# EAGLE design sustentation57-2 (EAGLE 5.07)
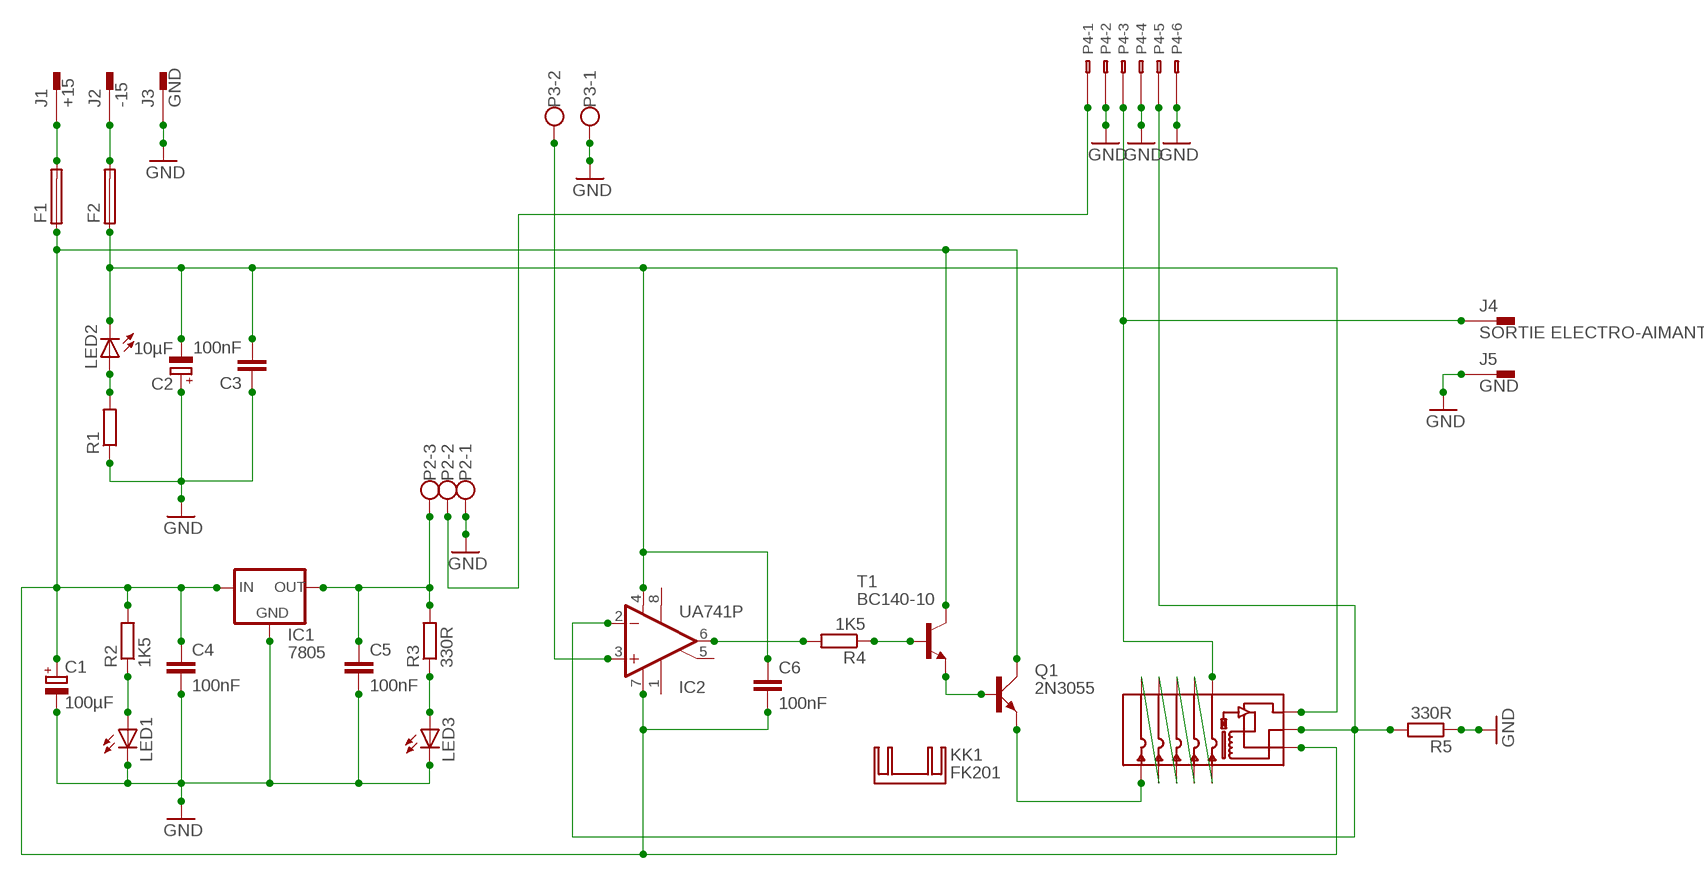
[diagram p0: schematic, sheet 1]

## Parts
C1  100µF  CPOL-EUE25-9AXIAL  [E25-9]
C2  10µF  CPOL-EUE5-5  [E5-5]
C3  100nF  C-EU050-024X044  [C050-024X044]
C4  100nF  C-EU050-024X044  [C050-024X044]
C5  100nF  C-EU050-024X044  [C050-024X044]
C6  100nF  C-EU050-024X044  [C050-024X044]
F1  KS9V  [KS9V]
F2  KS9V  [KS9V]
IC1  7805  78XXS  [78XXS]
IC2  UA741P  [DIL08]
J1  +15  PIN2F061.100  [F061.100]
J2  -15  PIN2F061.100  [F061.100]
J3  GND  PIN2F061.100  [F061.100]
J4  SORTIE ELECTRO-AIMANT  PIN2F061.100  [F061.100]
J5  GND  PIN2F061.100  [F061.100]
KK1  FK201  [FK201]
LED1  LED3MM  [LED3MM]
LED2  LED3MM  [LED3MM]
LED3  LED3MM  [LED3MM]
P2  W237-3E  [W237-3E]
P3  W237-02P  [W237-132]
P4  WAGO6-255-406-5  [255-406-5]
Q1  2N3055  [TO3A]
R1  R-EU_0309/10  [0309/10]
R2  1K5  R-EU_0309/10  [0309/10]
R3  330R  R-EU_0309/10  [0309/10]
R4  1K5  R-EU_0309/10  [0309/10]
R5  330R  R-EU_0309/10  [0309/10]
T1  BC140-10  BC140-10-NPN-TO39-EBC  [TO39]
U$1  LA25-NP  [LA25-NP]

## Nets
GND: C1.- C2.+ C3.1 C4.2 C5.2 IC1.GND J3.A1 J5.A1 LED1.K(C) LED3.K(C) P2.1 P3.1 P4.B2(-2:B1) P4.B4(-4:B1) P4.B6(-6:B1) R1.1 R5.1
N$1: F1.2 J1.A1
N$2: F2.2 J2.A1
N$3: C2.- C3.2 C6.1 F2.1 IC2.4(V-) LED2.K(C) U$1.-(V-)
N$4: LED2.A R1.2
N$5: LED3.A R3.1
N$6: C1.+ C4.1 C6.2 F1.1 IC1.IN IC2.7(V+) Q1.C1(C) R2.2 T1.3(C) U$1.+(V+)
N$7: LED1.A R2.1
N$8: C5.1 IC1.OUT P2.3 R3.2
N$9: IC2.3(+IN) P3.2
N$10: IC2.6(OUT) R4.2
N$11: Q1.B T1.1(E)
N$12: R4.1 T1.2(B)
N$13: P2.2 P4.B1(-1:B1)
N$14: Q1.E U$1.P$1
N$15: U$1.P$2 U$1.P$10
N$16: U$1.P$3 U$1.P$9
N$17: U$1.P$4 U$1.P$8
N$18: U$1.P$5 U$1.P$7
N$19: J4.A1 P4.B3(-3:B1) U$1.P$6
N$20: IC2.2(-IN) P4.B5(-5:B1) R5.2 U$1.M
Unconnected: IC2.1(ON1) IC2.5(ON2) IC2.8(OPT) J1.A2(1.1) J2.A2(1.1) J3.A2(1.1) J4.A2(1.1) J5.A2(1.1) P4.A1(-1:A1) P4.A2(-2:A1) P4.A3(-3:A1) P4.A4(-4:A1) P4.A5(-5:A1) P4.A6(-6:A1) Q1.C

## Library data of the parts
C1 C2 = rcl:CPOL-EU: POLARIZED CAPACITOR, European symbol
C3-C6 = rcl:C-EU: CAPACITOR, European symbol
F1 F2 = fuse:KS9V: FUSE HOLDER CS, Schukat
IC1 = v-reg:78XXS: VOLTAGE REGULATOR
IC2 = linear:*741: OP AMP
J1-J5 = con-faston:PIN2: Flachstecker Typ Tyco/Electronics/AMP TAB, FASTON Printed Circuit Board Tabs Source: http://www.buerklin.com, http://catalog.tycoelectronics.com
KK1 = heatsink:FK201: HEATSINK manufacturer Fischer/distributor Buerklin
LED1-LED3 = led:LED: LED OSRAM: - CHIPLED LG R971, LG N971, LY N971, LG Q971, LY Q971, LO R971, LY R971 LH N974, LH R974 LS Q976, LO Q976, LY Q976 LO Q996 - Hyper CHIPLED LW Q18S LB Q993, LB Q99A, LB R99A - SideLED LS A670, LO A670, LY A670, LG A670, LP A670 LB A673, LV A673, LT A673, LW A673 LH A674 LY A675 LS A676, LA A676, LO A676, LY A676, LW A676 LS A679, LY A679, LG A679 - Hyper Micro SIDELED® LS Y876, LA Y876, LO Y876, LY Y876 LT Y87S - SmartLED LW L88C, LW L88S LB L89C, LB L89S, LG L890 LS L89K, LO L89K, LY L89K LS L896, LA L896, LO L896, LY L896 - TOPLED LS T670, LO T670, LY T670, LG T670, LP T670 LSG T670, LSP T670, LSY T670, LOP T670, LYG T670 LG T671, LOG T671, LSG T671 LB T673, LV T673, LT T673, LW T673 LH T674 LS T676, LA T676, LO T676, LY T676, LB T676, LH T676, LSB T676, LW T676 LB T67C, LV T67C, LT T67C, LS T67K, LO T67K, LY T67K, LW E67C LS E67B, LA E67B, LO E67B, LY E67B, LB E67C, LV E67C, LT E67C LW T67C LS T679, LY T679, LG T679 LS T770, LO T770, LY T770, LG T770, LP T770 LB T773, LV T773, LT T773, LW T773 LH T774 LS E675, LA E675, LY E675, LS T675 LS T776, LA T776, LO T776, LY T776, LB T776 LHGB T686 LT T68C, LB T68C - Hyper Mini TOPLED® LB M676 - Mini TOPLED Santana® LG M470 LS M47K, LO M47K, LY M47K Source: http://www.osram.convergy.de LUXEON: - LUMILED® LXK2-PW12-R00, LXK2-PW12-S00, LXK2-PW14-U00, LXK2-PW14-V00 LXK2-PM12-R00, LXK2-PM12-S00, LXK2-PM14-U00 LXK2-PE12-Q00, LXK2-PE12-R00, LXK2-PE12-S00, LXK2-PE14-T00, LXK2-PE14-U00 LXK2-PB12-K00, LXK2-PB12-L00, LXK2-PB12-M00, LXK2-PB14-N00, LXK2-PB14-P00, LXK2-PB14-Q00 LXK2-PR12-L00, LXK2-PR12-M00, LXK2-PR14-Q00, LXK2-PR14-R00 LXK2-PD12-Q00, LXK2-PD12-R00, LXK2-PD12-S00 LXK2-PH12-R00, LXK2-PH12-S00 LXK2-PL12-P00, LXK2-PL12-Q00, LXK2-PL12-R00 Source: www.luxeon.com KINGBRIGHT: KA-3528ASYC Source: www.kingbright.com
P2 = con-wago-508:W237-3E: WAGO SREW CLAMP
P3 = con-wago-508:W237-02P: WAGO SREW CLAMP
P4 = con-wago:WAGO6-: WAGO Cage Clamp
Q1 = transistor-power:2N3055: NPN TRANSISTOR
R1-R5 = rcl:R-EU_: RESISTOR, European symbol
T1 = transistor:*-NPN-: NPN Transistror BF959 corrected 2008.03.06
U$1 = lem:LA25-NP

## Board
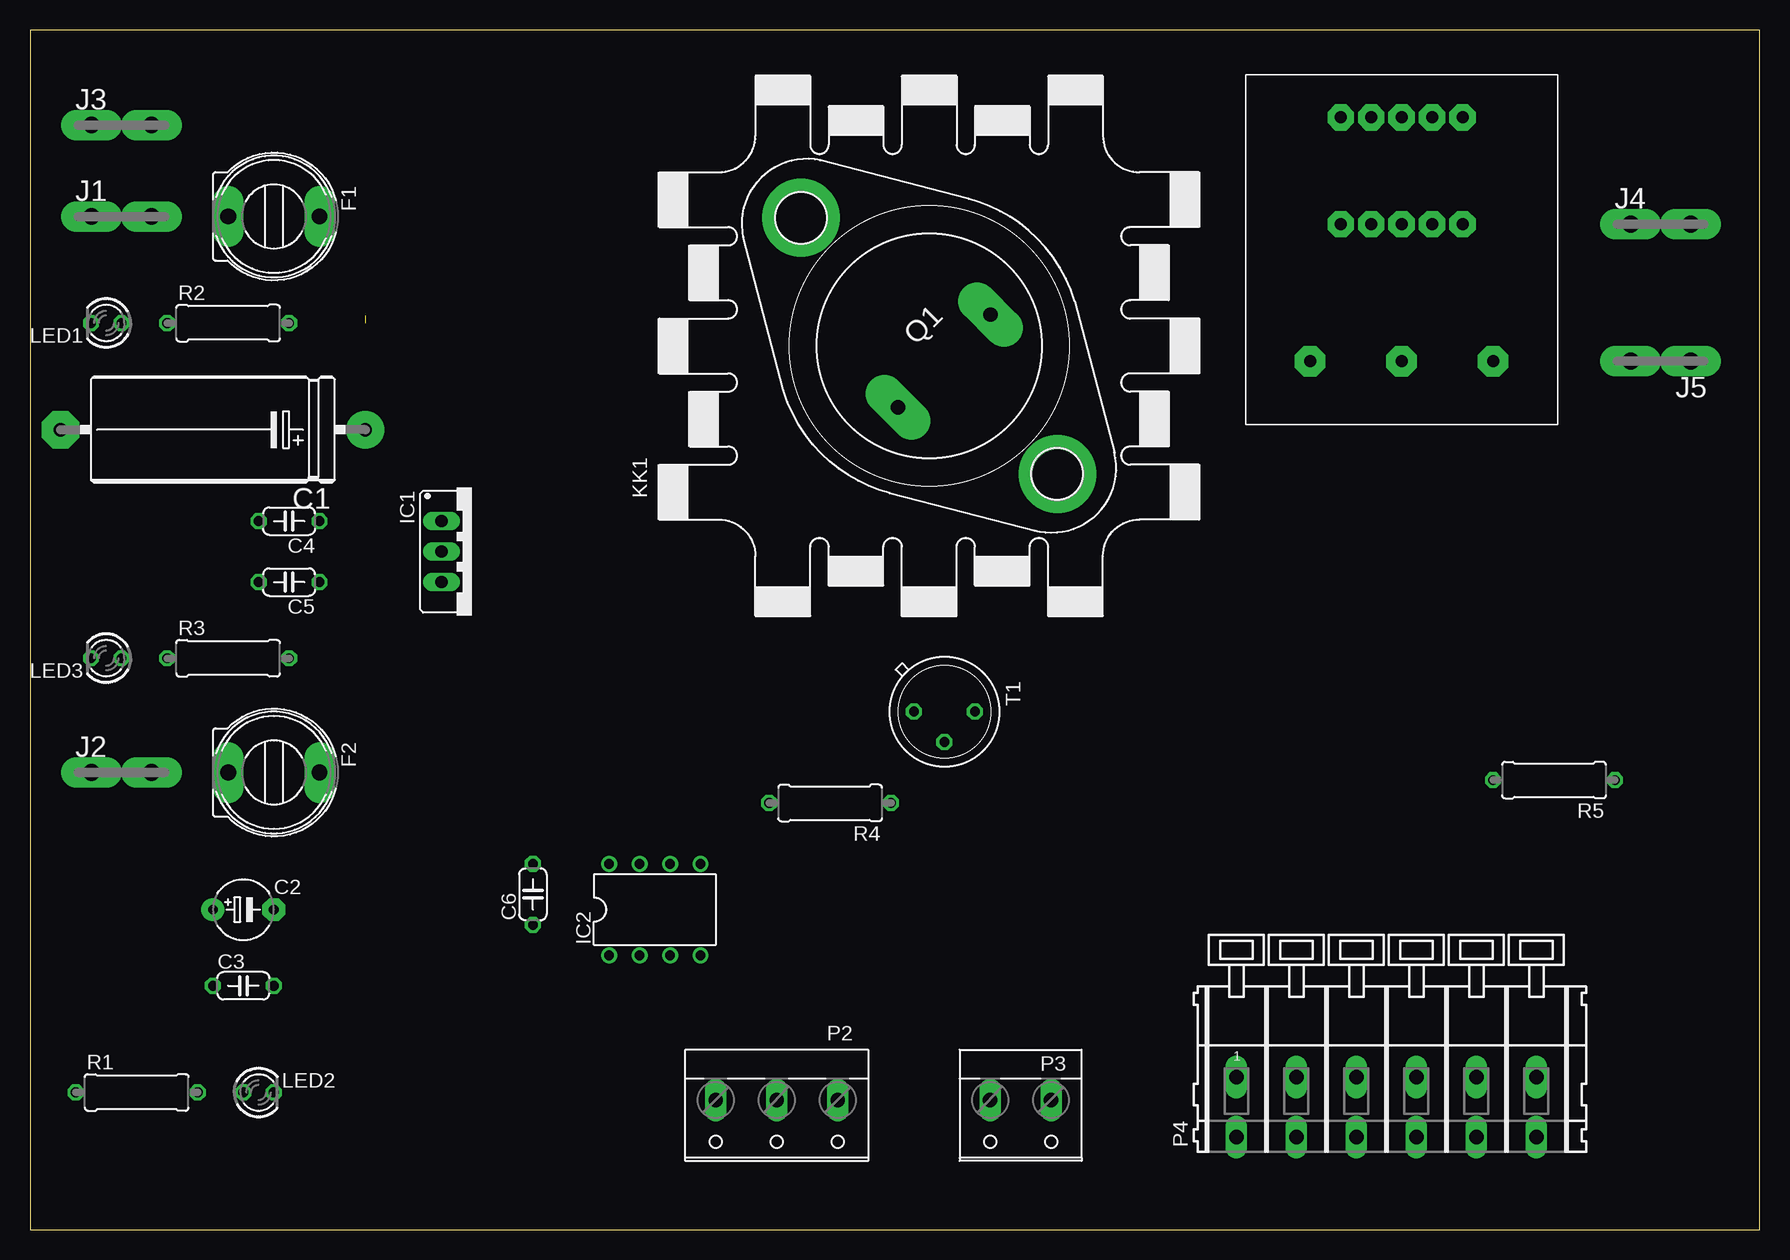
[diagram p1: board, top side]
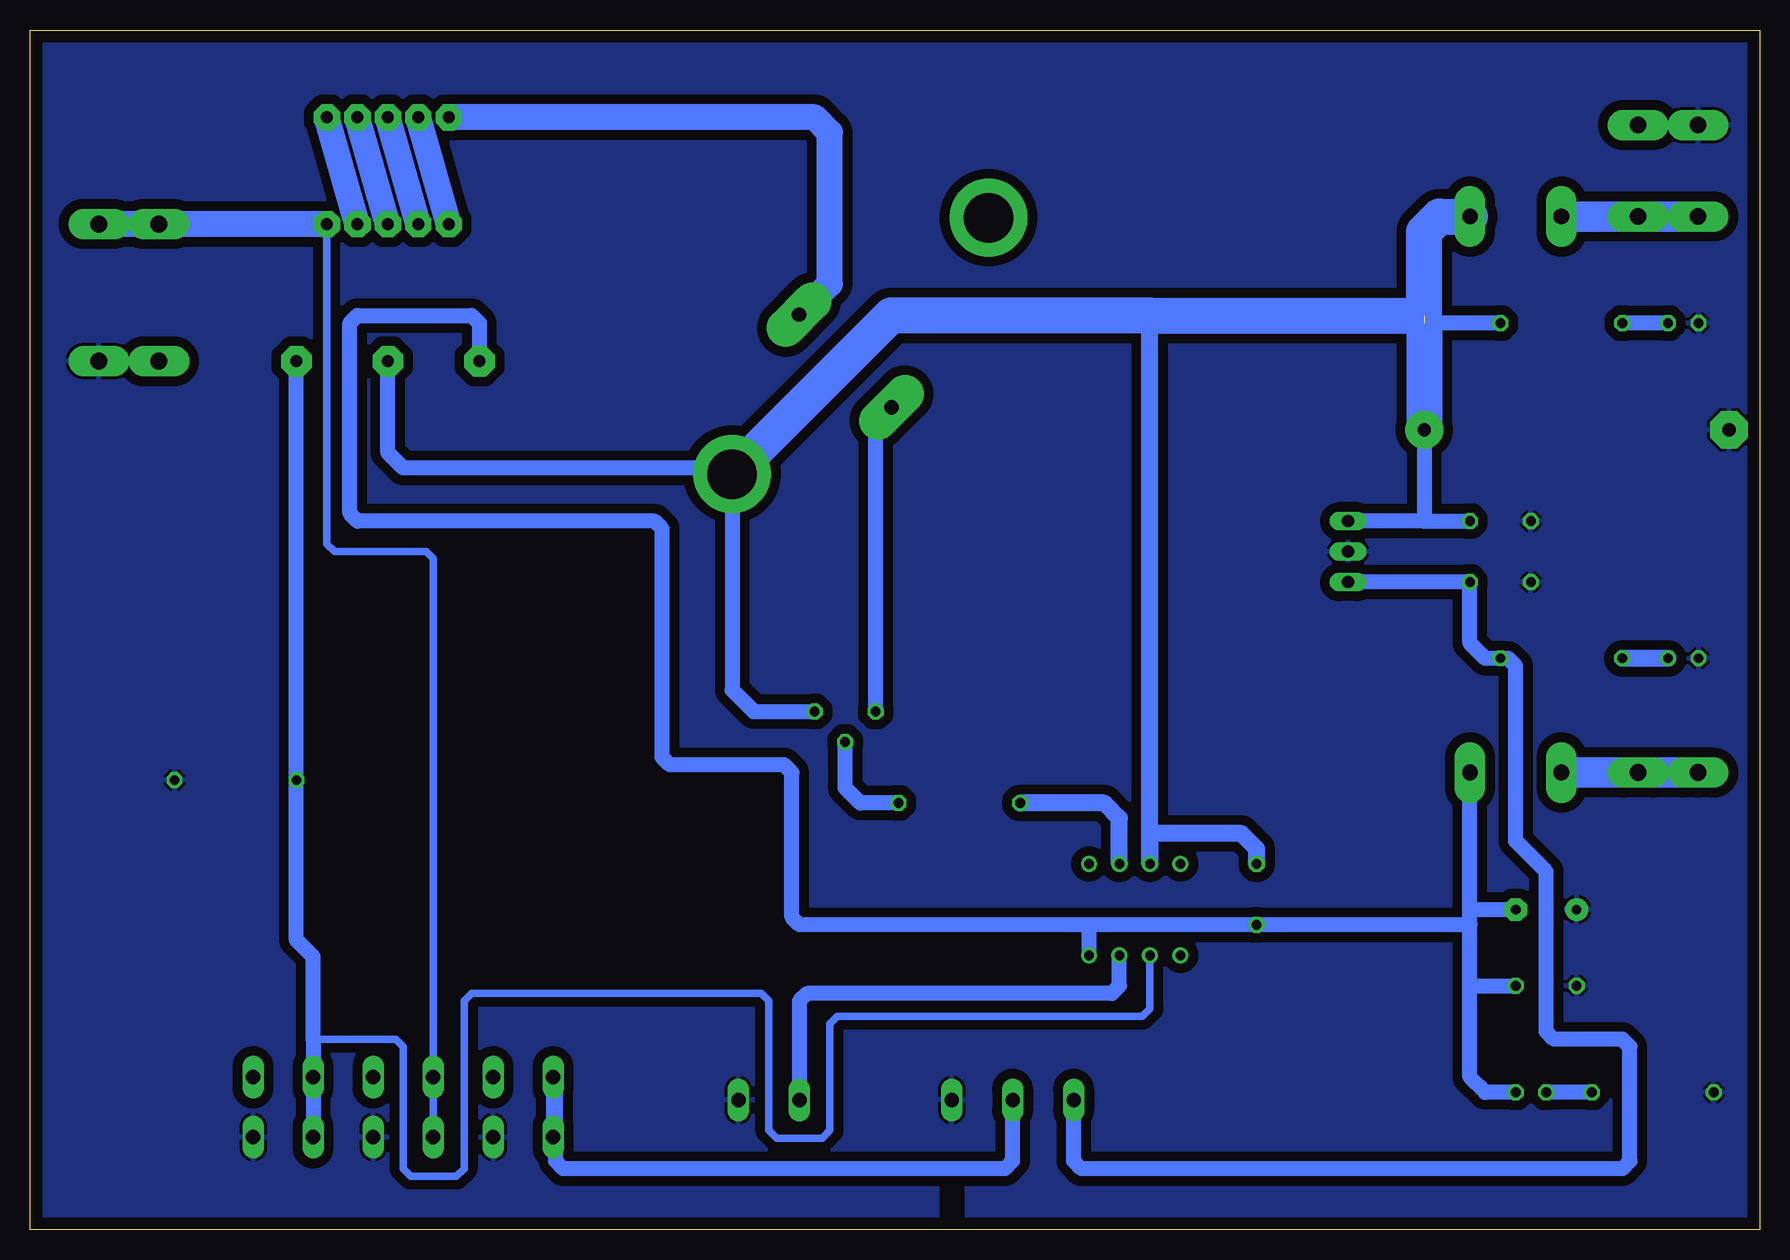
[diagram p2: board, bottom side, seen from below]

Size 144.12 x 100 mm. Coordinates in mm from the lower left corner, seen from the top.
Outline: 0,0 144.12,0 144.12,100 0,100 0,0
Copper layers (1*16): Top 0.035mm / dielectric 1.5mm / Bottom 0.035mm
Design rules "default": minimum track width 10mil, minimum drill 24mil, track to track 8mil, track to pad 8mil, pad to pad 8mil, via to via 8mil, smd to smd 8mil, copper to edge 40mil, drill to drill 8mil, minimum pad ring 10mil, minimum via ring 8mil, stop-mask expansion 4mil, vias tented up to drill 0mil, thermal gap 10mil

### Footprints (pad centres in the part's own frame; a part is rotated, then mirrored left to right if it is on the bottom)
E25-9 = drill 1.118 pad 3.15 round: + -12.7,0 | drill 1.118 pad 3.15 octagon: - 12.7,0
E5-5 = drill 0.813 pad 1.905 round: + -2.54,0 | drill 0.813 pad 1.905 octagon: - 2.54,0
C050-024X044 = drill 0.813 octagon: 1 -2.54,0; 2 2.54,0
KS9V = drill 1.321 pad 2.54 long: 1 0,3.81; 2 0,-3.81
78XXS = drill 1.016 long: GND 0,-2.54; IN -2.54,-2.54; OUT 2.54,-2.54
DIL08 = drill 0.813 pad 1.27 round: 1 -3.81,-3.81; 2 -1.27,-3.81; 3 1.27,-3.81; 4 3.81,-3.81; 5 3.81,3.81; 6 1.27,3.81; 7 -1.27,3.81; 8 -3.81,3.81
F061.100 = drill 1.4 pad 2.54 long: A1 -2.5,0; A2 2.5,0
LED3MM = drill 0.813 octagon: A -1.27,0; K 1.27,0
W237-3E = drill 1.194 long: 1 -5.08,-0.635; 2 0,-0.635; 3 5.08,-0.635
W237-132 = drill 1.194 long: 1 -2.54,-0.635; 2 2.54,-0.635
255-406-5 = drill 1.2 long: A1 -12.5,0; A2 -7.5,0; A3 -2.5,0; A4 2.5,0; A5 7.5,0; A6 12.5,0; B1 -12.5,-5; B2 -7.5,-5; B3 -2.5,-5; B4 2.5,-5; B5 7.5,-5; B6 12.5,-5
TO3A = drill 1.194 pad 3.15 long: B -1.778,5.461; E -1.778,-5.461 | drill 4.115 pad 6.477 round: C 15.113,0; C1 -15.113,0
0309/10 = drill 0.813 octagon: 1 -5.08,0; 2 5.08,0
TO39 = drill 0.813 octagon: 1 0,-2.54; 2 2.54,0; 3 0,2.54
LA25-NP = drill 1 pad 2.54 octagon: + 0,0; - -7.62,0; M 7.62,0 | drill 1 pad 2.184 octagon: P$1 -5.08,20.32; P$2 -2.54,20.32; P$3 0,20.32; P$4 2.54,20.32; P$5 5.08,20.32; P$6 5.08,11.43; P$7 2.54,11.43; P$8 0,11.43; P$9 -2.54,11.43; P$10 -5.08,11.43

### Placement (x,y rotation side)
C1  15.24,66.67 180 top
C2  17.78,26.67 0 top
C3  17.78,20.32 0 top
C4  21.59,59.05 180 top
C5  21.59,53.98 180 top
C6  41.91,27.94 90 top
F1  20.32,84.45 270 top
F2  20.32,38.1 270 top
IC1  36.83,56.52 270 top
IC2  52.07,26.67 0 top
J1  7.62,84.45 0 top
J2  7.62,38.1 0 top
J3  7.62,92.08 0 top
J4  135.89,83.82 0 top
J5  135.89,72.39 180 top
KK1  74.93,73.66 0 top
LED1  6.35,75.56 180 top
LED2  19.05,11.43 0 top
LED3  6.35,47.62 180 top
P2  62.23,10.16 180 top
P3  82.55,10.16 180 top
P4  113.03,12.7 0 top
Q1  74.93,73.66 135 top
R1  8.89,11.43 0 top
R2  16.51,75.56 0 top
R3  16.51,47.62 0 top
R4  66.67,35.56 180 top
R5  127,37.47 180 top
T1  76.2,43.18 270 top
U$1  114.3,72.39 0 top

### Tracks (layer width: path | path; a pad name or v marks a point on that pad's centre or on a via)
GND
  pour Bottom (isolate 0.813): 0,0 62.23,0 66.04,0 66.04,5.08 68.58,5.08 68.58,0 144.15,0 144.15,99.69 0,99.69
N$1
  Bottom 2.54: J1.A1 F1.2
N$2
  Bottom 2.54: J2.A1 F2.2
N$3
  Bottom 1.27: LED2.K 22.86,11.43 24.13,12.7 24.13,20.32 | 24.13,20.32 24.13,25.4 | 24.13,25.4 24.13,26.67 | 24.13,26.67 F2.1 | 24.13,26.67 C2.- | 24.13,20.32 C3.2 | 24.13,25.4 C6.1 55.88,25.4 | 55.88,25.4 IC2.4 | U$1.- 106.68,75.56 107.31,76.2 116.84,76.2 117.47,75.56 117.47,59.69 116.84,59.05 92.08,59.05 91.44,58.42 91.44,39.37 90.81,38.73 81.28,38.73 80.64,38.1 80.64,26.04 80.01,25.4 55.88,25.4
N$4
  Bottom 1.27: R1.2 LED2.A
N$5
  Bottom 1.422: LED3.A R3.1
N$6  (1 unrouted)
  Bottom 1.27: R2.2 27.94,75.56 | 27.94,59.05 C4.1 | 27.94,59.05 IC1.IN | C1.+ 27.94,59.05 | U$1.+ 114.3,64.77 113.03,63.5 85.09,63.5 | Q1.C1 85.62,44.98 83.82,43.18 T1.3
  Bottom 1.422: C6.2 41.91,31.75 43.18,33.02 50.8,33.02 IC2.7 50.8,76.2
  Bottom 2.184: 78.74,69.85 85.09,63.5
  Bottom 3: 27.94,76.2 C1.+ | 27.94,76.2 27.94,83.19 26.67,84.45 F1.1 | Q1.C1 78.74,69.85 72.39,76.2 50.8,76.2 27.94,76.2
N$7
  Bottom 1.27: LED1.A R2.1
N$8
  Bottom 1.27: IC1.OUT C5.1 24.13,48.9 22.86,47.62 R3.2 20.95,47.62 20.32,46.99 20.32,32.38 17.78,29.84 17.78,16.51 17.14,15.88 11.43,15.88 10.79,15.24 10.79,5.71 11.43,5.08 56.52,5.08 57.15,5.71 P2.3
N$9
  Bottom 1.27: IC2.3 53.34,20.32 53.98,19.68 79.38,19.68 80.01,19.05 P3.2
N$10
  Bottom 1.422: IC2.6 53.34,34.29 54.61,35.56 R4.2
N$11
  Bottom 1.27: 72.43,68.54 73.66,67.31 T1.1
  Bottom 2.184: 72.43,68.54 Q1.B
N$12
  Bottom 1.27: T1.2 76.2,36.83 74.93,35.56 R4.1
N$13
  Bottom 1.27: P2.2 62.23,5.71 62.87,5.08 99.69,5.08 100.33,5.71 100.33,13.34 100.53,13.34 P4.B1
N$14
  Bottom 2.184: Q1.E 77.47,78.84 77.47,91.44 78.74,92.71 U$1.P$1
N$15
  Bottom 2.184: U$1.P$10 U$1.P$2
N$16
  Bottom 2.184: U$1.P$9 U$1.P$3
N$17
  Bottom 2.184: U$1.P$8 U$1.P$4
N$18
  Bottom 2.184: U$1.P$7 U$1.P$5
N$19
  Bottom 0.61: U$1.P$6 119.38,57.15 118.75,56.52 111.12,56.52 110.53,55.92 P4.B3
  Bottom 2.184: U$1.P$6 J4.A1 139.7,83.82
N$20
  Bottom 0.61: IC2.2 50.8,18.41 51.44,17.78 76.83,17.78 77.47,17.14 77.47,8.26 78.11,7.62 81.92,7.62 82.55,8.26 82.55,19.05 83.19,19.68 107.31,19.68 107.95,19.05 107.95,5.08 108.58,4.45 112.39,4.45 113.03,5.08 113.03,15.24 113.67,15.88 120.53,15.88
  Bottom 1.27: P4.B5 120.53,15.88 120.53,22.74 121.92,24.13 R5.2 U$1.M